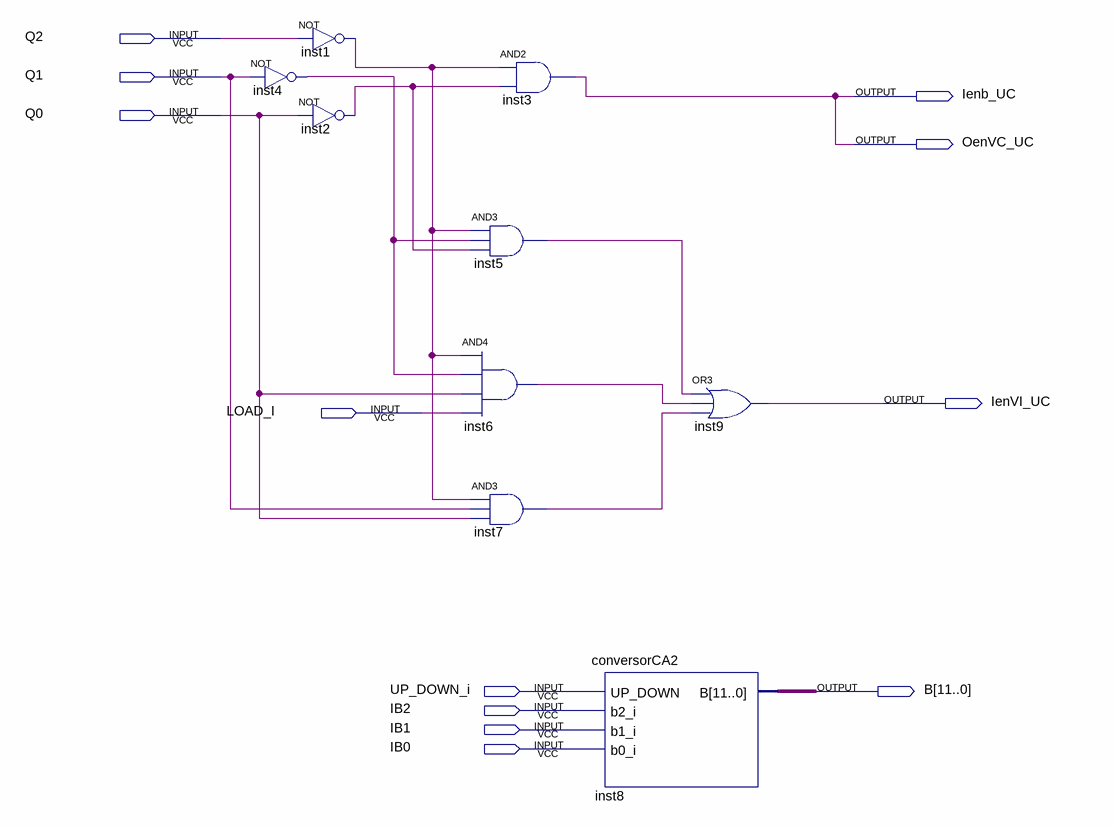
[diagram p0: schematic sheet]
// Quartus schematic UC_de_UC.bdf as structural Verilog: 9 symbols, 12 pins
module UC_de_UC (
  input  Q2,
  input  Q1,
  input  Q0,
  input  LOAD_I,
  input  UP_DOWN_i,
  input  IB2,
  input  IB1,
  input  IB0,
  output Ienb_UC,
  output OenVC_UC,
  output IenVI_UC,
  output [11:0] B
);

  wire inst1_out, inst2_out, inst4_out, inst5_out, inst6_out, inst7_out;

  not inst4 (inst4_out, Q1);
  not inst1 (inst1_out, Q2);
  not inst2 (inst2_out, Q0);
  and inst5 (inst5_out, inst1_out, inst4_out, inst2_out);
  and inst6 (inst6_out, inst1_out, inst4_out, Q0, LOAD_I);
  and inst7 (inst7_out, inst1_out, Q1, Q0);
  and inst3 (Ienb_UC, inst1_out, inst2_out);
  conversorCA2 inst8 (.UP_DOWN(UP_DOWN_i), .b2_i(IB2), .b1_i(IB1), .b0_i(IB0), .B(B));
  or inst9 (IenVI_UC, inst5_out, inst6_out, inst7_out);

  assign OenVC_UC = Ienb_UC;
endmodule
